# EAGLE design main (EAGLE 7.6.0)
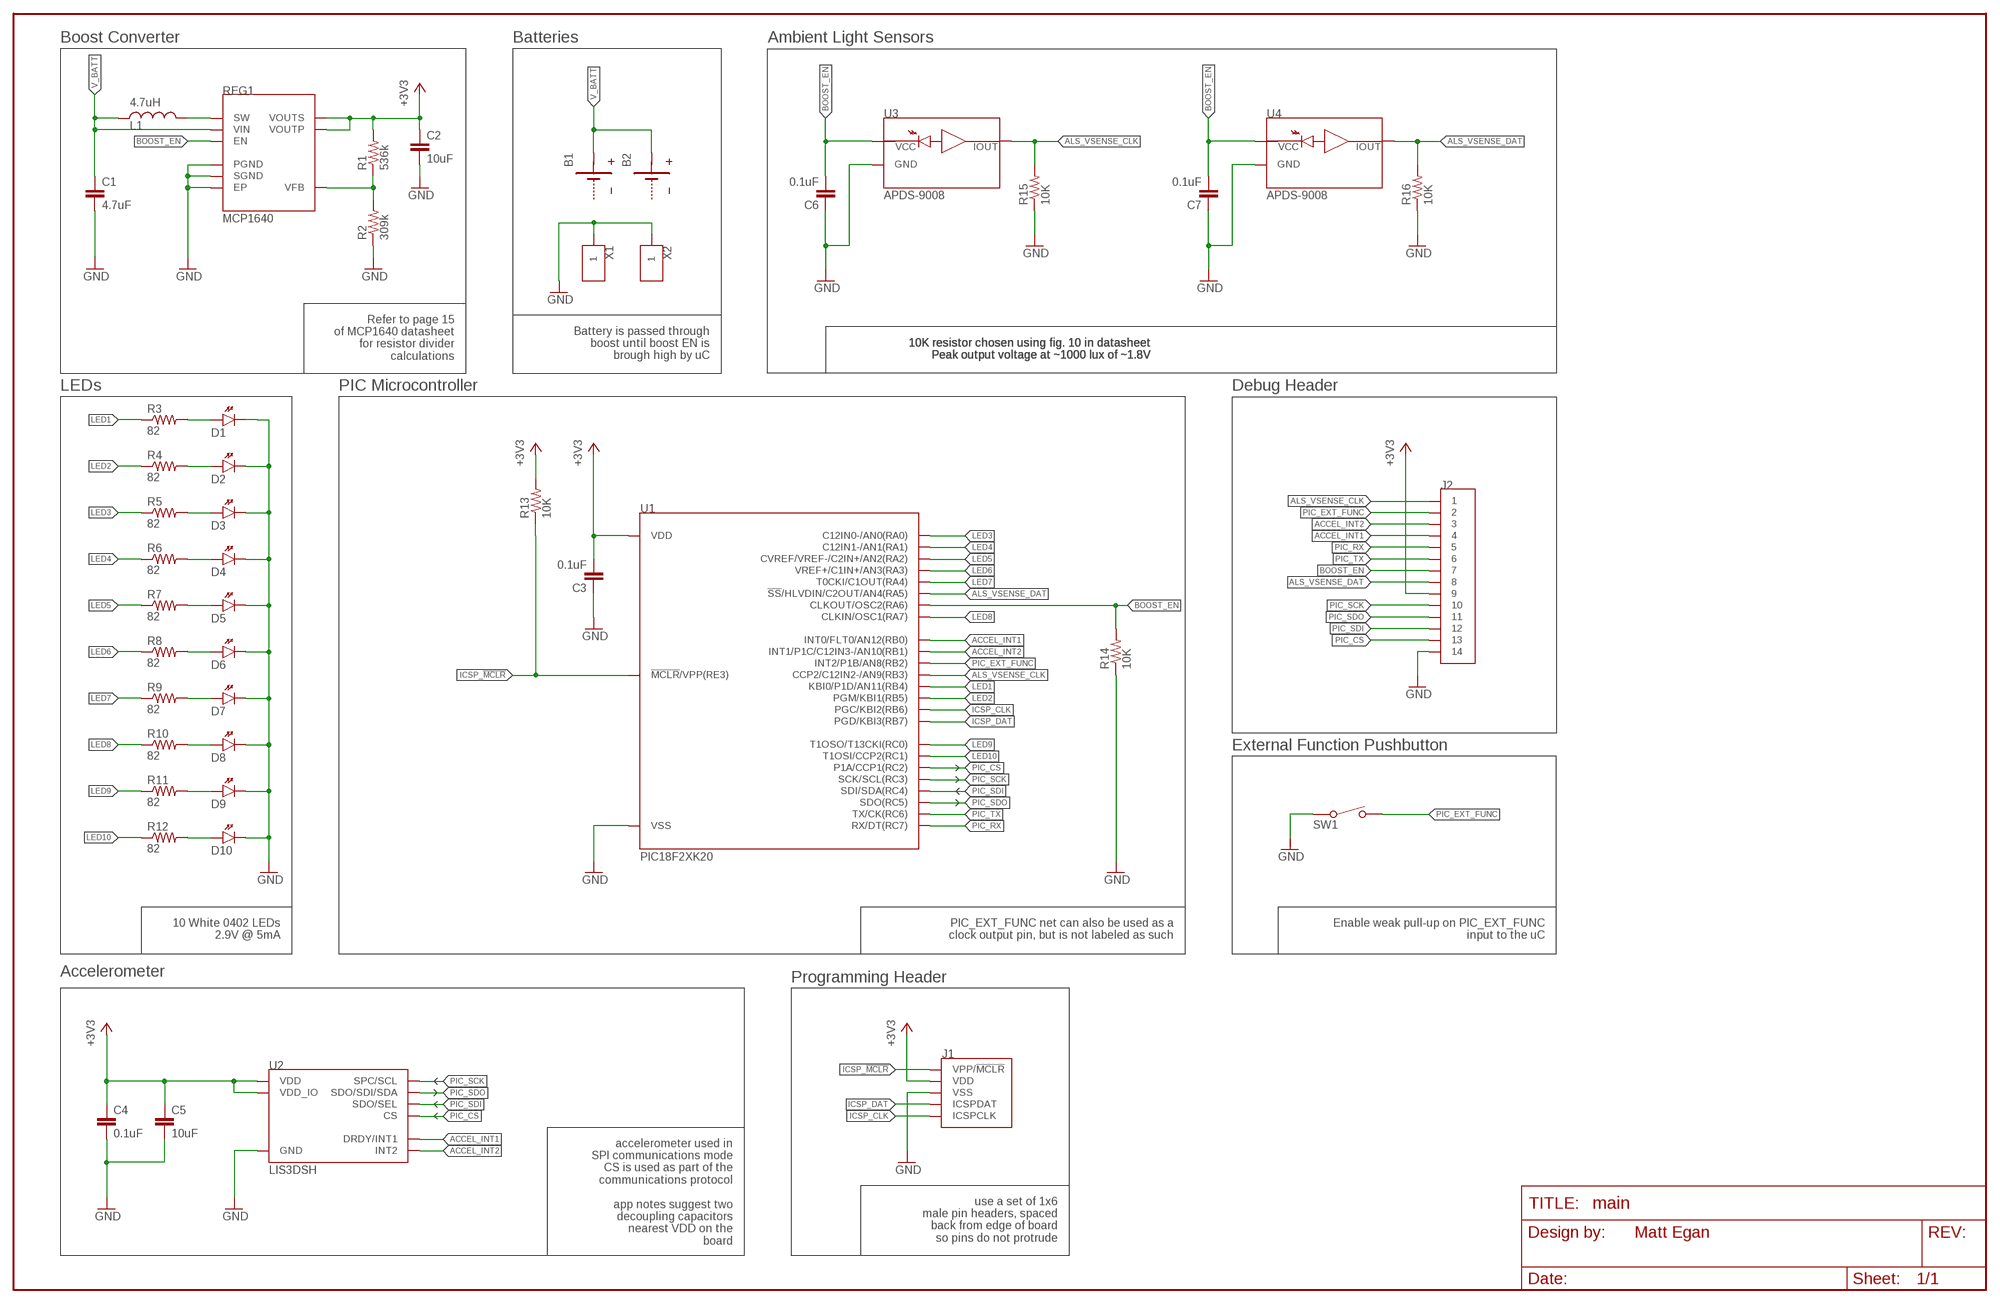
[diagram p0: schematic, sheet 1]

## Parts
B1  BATTERY-POS-HALF  [CR20XX-PLATED]
B2  BATTERY-POS-HALF  [CR20XX-PLATED]
C1  4.7uF  CAPACITOR0603  [SMD-0603]
C2  10uF  CAPACITOR0603  [SMD-0603]
C3  0.1uF  CAPACITOR0805  [SMD-0805]
C4  0.1uF  CAPACITOR0805  [SMD-0805]
C5  10uF  CAPACITOR0805  [SMD-0805]
C6  0.1uF  CAPACITOR0805  [SMD-0805]
C7  0.1uF  CAPACITOR0805  [SMD-0805]
D1  LED0603  [SMD-0603-P]
D2  LED0603  [SMD-0603-P]
D3  LED0603  [SMD-0603-P]
D4  LED0603  [SMD-0603-P]
D5  LED0603  [SMD-0603-P]
D6  LED0603  [SMD-0603-P]
D7  LED0603  [SMD-0603-P]
D8  LED0603  [SMD-0603-P]
D9  LED0603  [SMD-0603-P]
D10  LED0603  [SMD-0603-P]
J1  ICSP-HEADER1X6-0.1-ICSP-PADS  [1X6-0.1-ICSP-PADS]
J2  HEADER-141X14-0.05-PADS  [1X14-0.05-PADS]
L1  4.7uH  INDUCTOR  [VLF403210MT]
R1  536k  RESISTOR0603  [SMD-0603]
R2  309k  RESISTOR0603  [SMD-0603]
R3  82  RESISTOR0603  [SMD-0603]
R4  82  RESISTOR0603  [SMD-0603]
R5  82  RESISTOR0603  [SMD-0603]
R6  82  RESISTOR0603  [SMD-0603]
R7  82  RESISTOR0603  [SMD-0603]
R8  82  RESISTOR0603  [SMD-0603]
R9  82  RESISTOR0603  [SMD-0603]
R10  82  RESISTOR0603  [SMD-0603]
R11  82  RESISTOR0603  [SMD-0603]
R12  82  RESISTOR0603  [SMD-0603]
R13  10K  RESISTOR0603  [SMD-0603]
R14  10K  RESISTOR0603  [SMD-0603]
R15  10K  RESISTOR0603  [SMD-0603]
R16  10K  RESISTOR0603  [SMD-0603]
REG1  MCP1640  [DFN-8(2X3)]
SW1  B3U-3000P  [B3U-3000P]
U1  PIC18F2XK20  [QFN-28]
U2  LIS3DSH  [LGA-16]
U3  APDS-9008  [AVAGO-CHIPLED6]
U4  APDS-9008  [AVAGO-CHIPLED6]
X1  TE-2199248-X  [TE-2199248-X]
X2  TE-2199248-X  [TE-2199248-X]

## Nets
+3V3: C2.1 C3.2 C4.1 C5.1 J1.P$2(VDD) J2.P$9 R1.2 R13.2 REG1.6(VOUTP) REG1.7(VOUTS) U1.P$17(VDD) U2.P$1(VDD_IO) U2.P$14(VDD) U2.P$15(VDD)
ACCEL_INT1: J2.P$4 U1.P$18(INT0/FLT0/AN12(RB0)) U2.P$11(DRDY/INT1)
ACCEL_INT2: J2.P$3 U1.P$19(INT1/P1C/C12IN3-/AN10(RB1)) U2.P$9(INT2)
ALS_VSENSE_CLK: J2.P$1 R15.2 U1.P$21(CCP2/C12IN2-/AN9(RB3)) U3.P$6(P$IOUT)
ALS_VSENSE_DAT: J2.P$8 R16.2 U1.P$4(!SS!/HLVDIN/C2OUT/AN4(RA5)) U4.P$6(P$IOUT)
BOOST_EN: C6.2 C7.2 J2.P$7 R14.2 REG1.4(EN) U1.P$7(CLKOUT/OSC2(RA6)) U3.P$1(P$VCC) U4.P$1(P$VCC)
GND: C1.2 C2.2 C3.1 C4.2 C5.2 C6.1 C7.1 D1.- D2.- D3.- D4.- D5.- D6.- D7.- D8.- D9.- D10.- J1.P$3(VSS) J2.P$14 R2.1 R14.1 R15.1 R16.1 REG1.2(SGND) REG1.3(PGND) REG1.EP SW1.SW$1 U1.P$5(VSS) U1.P$16(VSS) U2.P$5(GND) U2.P$10(GND) U2.P$12(GND) U2.P$13(GND) U2.P$16(GND) U3.P$4(GND) U4.P$4(GND) X1.P$1 X1.P$2 X2.P$1 X2.P$2
ICSP_!MCLR!: J1.P$1(VPP/!MCLR!) R13.1 U1.P$26(!MCLR!/VPP(RE3))
ICSP_CLK: J1.P$5(ICSPCLK) U1.P$24(PGC/KBI2(RB6))
ICSP_DAT: J1.P$4(ICSPDAT) U1.P$25(PGD/KBI3(RB7))
LED1: R3.1 U1.P$22(KBI0/P1D/AN11(RB4))
LED2: R4.1 U1.P$23(PGM/KBI1(RB5))
LED3: R5.1 U1.P$27(C12IN0-/AN0(RA0))
LED4: R6.1 U1.P$28(C12IN1-/AN1(RA1))
LED5: R7.1 U1.P$1(CVREF/VREF-/C2IN+/AN2(RA2))
LED6: R8.1 U1.P$2(VREF+/C1IN+/AN3(RA3))
LED7: R9.1 U1.P$3(T0CKI/C1OUT(RA4))
LED8: R10.1 U1.P$6(CLKIN/OSC1(RA7))
LED9: R11.1 U1.P$8(T1OSO/T13CKI(RC0))
LED10: R12.1 U1.P$9(T1OSI/CCP2(RC1))
N$3: L1.P$2 REG1.5(SW)
N$5: R1.1 R2.2 REG1.1(VFB)
N$7: D1.+ R3.2
N$8: D2.+ R4.2
N$9: D3.+ R5.2
N$10: D4.+ R6.2
N$11: D5.+ R7.2
N$12: D6.+ R8.2
N$13: D7.+ R9.2
N$14: D8.+ R10.2
N$15: D9.+ R11.2
N$16: D10.+ R12.2
PIC_CS: J2.P$13 U1.P$10(P1A/CCP1(RC2)) U2.P$8(CS)
PIC_EXT_FUNC: J2.P$2 SW1.SW$2 U1.P$20(INT2/P1B/AN8(RB2))
PIC_RX: J2.P$5 U1.P$15(RX/DT(RC7))
PIC_SCK: J2.P$10 U1.P$11(SCK/SCL(RC3)) U2.P$4(SPC/SCL)
PIC_SDI: J2.P$12 U1.P$12(SDI/SDA(RC4)) U2.P$7(SDO/SEL)
PIC_SDO: J2.P$11 U1.P$13(SDO(RC5)) U2.P$6(SDO/SDI/SDA)
PIC_TX: J2.P$6 U1.P$14(TX/CK(RC6))
V_BATT: B1.P$1(P$+) B2.P$1(P$+) C1.1 L1.P$1 REG1.8(VIN)

## Notes on the sheet
- Boost Converter | Batteries | Ambient Light Sensors
- Refer to page 15
  of MCP1640 datasheet
  for resistor divider
  calculations
- Battery is passed through
  boost until boost EN is
  brough high by uC
- 10K resistor chosen using fig. 10 in datasheet
  Peak output voltage at ~1000 lux of ~1.8V
- 10K resistor chosen using fig. 10 in datasheet
  Peak output voltage at ~1000 lux of ~1.8V
- 10K resistor chosen using fig. 10 in datasheet
  Peak output voltage at ~1000 lux of ~1.8V
- LEDs | PIC Microcontroller | Debug Header
- External Function Pushbutton
- 10 White 0402 LEDs
  2.9V @ 5mA
- PIC_EXT_FUNC net can also be used as a
  clock output pin, but is not labeled as such
- Enable weak pull-up on PIC_EXT_FUNC
  input to the uC
- Accelerometer
- Programming Header
- accelerometer used in
  SPI communications mode
  CS is used as part of the
  communications protocol
  
  app notes suggest two
  decoupling capacitors
  nearest VDD on the
  board
- use a set of 1x6
  male pin headers, spaced
  back from edge of board
  so pins do not protrude
- Matt Egan

## Library data of the parts
B1 B2 = matt:BATTERY-POS-HALF
C1-C7 = matt:CAPACITOR
D1-D10 = matt:LED
J1 = matt:ICSP-HEADER
J2 = matt:HEADER-14
L1 = matt:INDUCTOR
R1-R16 = matt:RESISTOR
REG1 = matt:MCP1640
SW1 = matt:B3U-3000P
U1 = matt:PIC18F2XK20
U2 = matt:LIS3DSH
U3 U4 = matt:APDS-9008
X1 X2 = matt:TE-2199248-X

## Net classes
0 default: clearance 0.152 mm

## Board
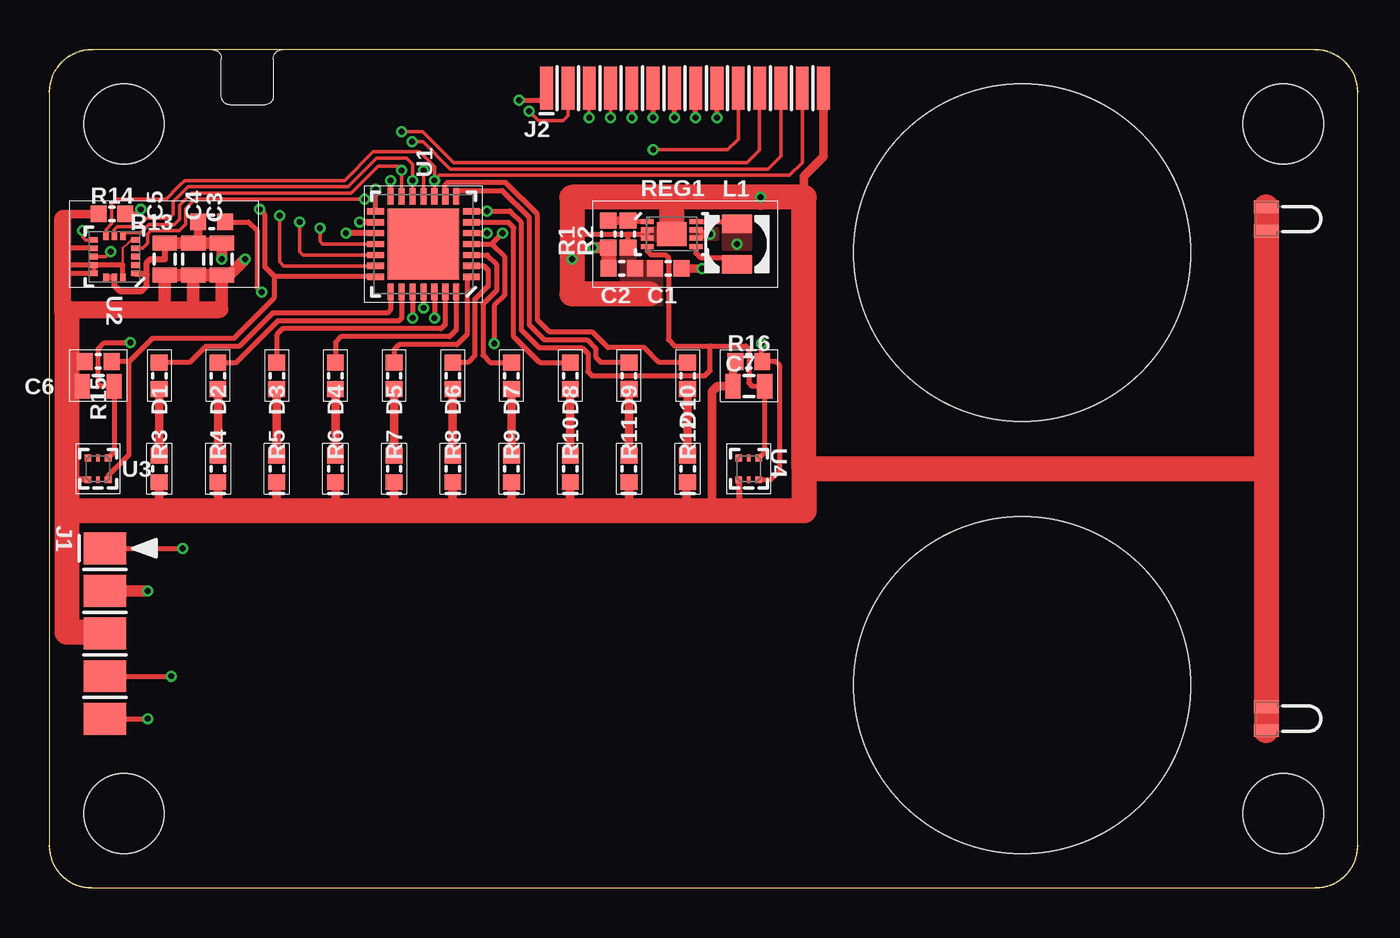
[diagram p1: board, top side]
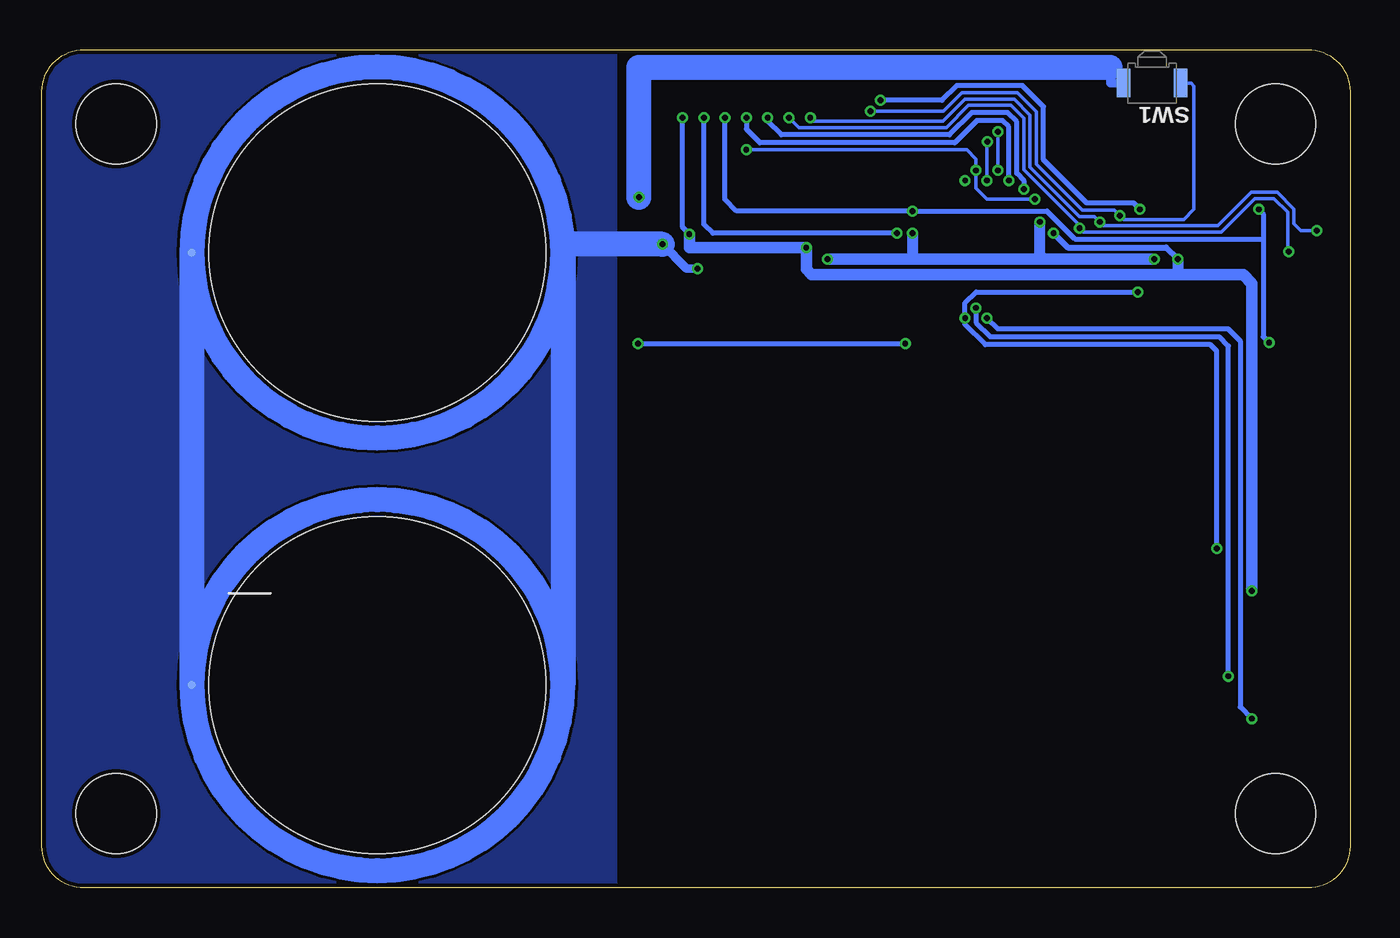
[diagram p2: board, bottom side, seen from below]

Size 78 x 50 mm. Coordinates in mm from the lower left corner, seen from the top.
Outline: 78,47.6 78,2.5 arc-90 75.5,0 2.5,0 arc-90 0,2.5 0,47.5 arc-90 2.5,50 75.6,50
Outline: 78,47.5 arc90 75.5,50
Copper layers (1*16): Top 0.035mm / dielectric 1.5mm / Bottom 0.035mm
Design rules "main": minimum track width 6mil, minimum drill 12mil, track to track 6mil, track to pad 6mil, pad to pad 6mil, via to via 6mil, smd to smd 0mil, copper to edge 10mil, drill to drill 10mil, minimum pad ring 10mil, minimum via ring 6mil, stop-mask expansion 2mil, vias tented up to drill 25mil, thermal gap 10mil
Holes 4.76 mm at 4.43,4.43 4.43,45.57 73.57,45.57 73.57,4.43

### Footprints (pad centres in the part's own frame; a part is rotated, then mirrored left to right if it is on the bottom)
CR20XX-PLATED = smd 0.5 x 0.5: P$1 0,11.06 | hole 20.1: 0,0
SMD-0603 = smd 0.95 x 1: 1 -0.8,0; 2 0.8,0
SMD-0805 = smd 0.9 x 1.45: 1 -0.95,0; 2 0.95,0
SMD-0603-P = smd 0.95 x 1: + -0.8,0; - 0.8,0
1X6-0.1-ICSP-PADS = smd 2.54 x 1.905: P$1 0,5.08; P$2 0,2.54; P$3 0,0; P$4 0,-2.54; P$5 0,-5.08
1X14-0.05-PADS = smd 2.54 x 0.762: P$1 0,8.255; P$2 0,6.985; P$3 0,5.715; P$4 0,4.445; P$5 0,3.175; P$6 0,1.905; P$7 0,0.635; P$8 0,-0.635; P$9 0,-1.905; P$10 0,-3.175; P$11 0,-4.445; P$12 0,-5.715; P$13 0,-6.985; P$14 0,-8.255
VLF403210MT = smd 1.1 x 1.8: P$1 -1.2,0; P$2 1.2,0
DFN-8(2X3) = smd 0.3 x 0.75: 1 -0.75,-1.45; 2 -0.25,-1.45; 3 0.25,-1.45; 4 0.75,-1.45; 5 0.75,1.45; 6 0.25,1.45; 7 -0.25,1.45; 8 -0.75,1.45 | smd 1.45 x 1.75: EP 0,0
B3U-3000P = smd 0.8 x 1.7: SW$1 -1.7,0; SW$2 1.7,0
QFN-28 = smd 1 x 0.37: P$1 -2.85,1.95; P$2 -2.85,1.3; P$3 -2.85,0.65; P$4 -2.85,0; P$5 -2.85,-0.65; P$6 -2.85,-1.3; P$7 -2.85,-1.95; P$15 2.85,-1.95; P$16 2.85,-1.3; P$17 2.85,-0.65; P$18 2.85,0; P$19 2.85,0.65; P$20 2.85,1.3; P$21 2.85,1.95 | smd 0.37 x 1: P$8 -1.95,-2.85; P$9 -1.3,-2.85; P$10 -0.65,-2.85; P$11 0,-2.85; P$12 0.65,-2.85; P$13 1.3,-2.85; P$14 1.95,-2.85; P$22 1.95,2.85; P$23 1.3,2.85; P$24 0.65,2.85; P$25 0,2.85; P$26 -0.65,2.85; P$27 -1.3,2.85; P$28 -1.95,2.85 | smd 4.25 x 4.25: P$29 0,0
LGA-16 = smd 0.45 x 0.34: P$1 -1.225,1; P$2 -1.225,0.5; P$3 -1.225,0; P$4 -1.225,-0.5; P$5 -1.225,-1; P$9 1.225,-1; P$10 1.225,-0.5; P$11 1.225,0; P$12 1.225,0.5; P$13 1.225,1 | smd 0.34 x 0.45: P$6 -0.5,-1.225; P$7 0,-1.225; P$8 0.5,-1.225; P$14 0.5,1.225; P$15 0,1.225; P$16 -0.5,1.225
AVAGO-CHIPLED6 = smd 0.4 x 0.4: P$1 0.6,0.65; P$3 -0.6,0.65; P$4 -0.6,-0.65; P$6 0.6,-0.65 | smd 0.2 x 0.4: P$2 0,0.65; P$5 0,-0.65
TE-2199248-X = smd 1.5 x 0.75: P$1 0,-0.725; P$2 0,0.725

### Placement (x,y rotation side)
B1  58,12.1 90 bottom
B2  58,37.9 90 bottom
C1  36.9,36.95 180 top
C2  34.12,36.95 0 top
C3  10.28,37.5 90 top
C4  8.57,37.5 270 top
C5  6.88,37.5 270 top
C6  2.9,29.93 0 top
C7  41.7,29.93 0 top
D1  6.55,25 270 top
D2  10.05,25 270 top
D3  13.55,25 270 top
D4  17.05,25 270 top
D5  20.55,25 270 top
D6  24.05,25 270 top
D7  27.55,25 270 top
D8  31.05,25 270 top
D9  34.55,25 270 top
D10  38.05,25 270 top
J1  3.3,15.18 0 top
J2  37.9,47.7 90 top
L1  41,38.4 270 top
R1  33.33,39 270 top
R2  34.5,39 90 top
R3  6.55,30.55 270 top
R4  10.05,30.55 270 top
R5  13.55,30.55 270 top
R6  17.05,30.55 270 top
R7  20.55,30.55 270 top
R8  24.05,30.55 270 top
R9  27.55,30.55 270 top
R10  31.05,30.55 270 top
R11  34.55,30.55 270 top
R12  38.05,30.55 270 top
R13  9.68,39.73 180 top
R14  3.73,40.2 0 top
R15  2.9,31.4 0 top
R16  41.7,31.4 0 top
REG1  37.1,39 270 top
SW1  11.8,48 0 bottom
U1  22.3,38.4 180 top
U2  3.88,37.65 180 top
U3  2.9,25 0 top
U4  41.7,25 0 top
X1  72.55,10.1 0 top
X2  72.55,39.9 0 top

### Tracks (layer width: path | path; a pad name or v marks a point on that pad's centre or on a via)
+3V3  (via drill 0.35)
  Top 0.3: v39.8,45.95 J2.P$9
  Top 0.35: U2.P$14 U2.P$15 3.88,35.92 4.2,35.6 5.5,35.6 5.8,35.9 5.8,36.6 | 5.8,36.6 5.8,37.3 6,37.5 6.9,37.5 6.9,38.42 C5.1 | U2.P$1 5.75,36.65 5.8,36.6 | C3.2 10.28,38.48 | 10.28,38.48 10.3,38.5 | 10.28,38.48 10.25,38.45 | U1.P$17 v17.68,39.05
  Top 0.5: v39.4,39 39,39 | 8.88,38.45 R13.2
  Top 0.65: C3.2 v10.28,37.5
  Top 0.7: R1.2 v32.42,38.2 | C5.1 C4.1 8.88,38.45 10.25,38.45 | v5.85,17.71 J1.P$2
  Top 0.9: R1.2 C2.1
  Bottom 0.3: v39.4,39 39.8,39.4 v39.8,45.95
  Bottom 0.35: v17.68,39.05 16.82,38.2 10.97,38.2 v10.28,37.5
  Bottom 0.65: v10.28,37.5 10.28,36.58 10.25,36.58
  Bottom 0.7: v39.4,39 39.4,38.2 v32.42,38.2 32.42,36.9 32.1,36.58 10.25,36.58 6.38,36.58 5.85,36.05 v5.85,17.71
  pour Top (no thermals): 38.27,39.3 38.27,38.7 39.83,38.7 39.83,39.3
ACCEL_INT1  (via drill 0.35)
  Top 0.2: U2.P$11 3.35,37.65 v3.65,37.95 | U1.P$18 16.3,38.4 16.12,38.58 v16.12,39.35 | J2.P$4 v33.45,45.95
  Bottom 0.2: v3.65,37.95 3.73,38.02 3.73,40.3 4.55,41.12 5.67,41.12 7.67,39.12 15.9,39.12 v16.12,39.35 16.12,39.52 19.45,42.85 19.45,45.9 20.23,46.67 22.75,46.67 24.07,45.35 32.85,45.35 v33.45,45.95
ACCEL_INT2  (via drill 0.35)
  Top 0.2: U2.P$9 2.17,38.65 1.98,38.85 v1.98,39.2 | U1.P$19 15.12,37.75 14.93,37.95 v14.93,39.73 | J2.P$3 v32.19,45.95
  Top 0.3: J2.P$3
  Bottom 0.2: v1.98,39.2 2.92,39.2 3.35,39.62 3.35,40.5 4.35,41.5 5.88,41.5 7.88,39.5 14.7,39.5 v14.93,39.73 15.25,40.05 16.12,40.05 19.07,43 19.07,46.1 20.02,47.05 22.95,47.05 24.27,45.73 31.96,45.73 v32.19,45.95
ALS_VSENSE_CLK  (via drill 0.35)
  Top 0.3: 4.75,31.4 4.75,25.85 3.5,24.6 U3.P$6 | 4.75,31.4 R15.2 | 4.75,31.4 6.12,32.77 10.97,32.77 13.43,35.23 13.43,36.45 | U1.P$21 13.43,36.45 | 13.43,36.45 12.85,37.02 12.85,40.15 v12.53,40.48 | J2.P$1 arc90 29.62,47.68 29.62,46.92 arc90 29.57,46.98 v28,46.98
  Bottom 0.3: v12.53,40.48 12.9,40.85 15.7,40.85 18.27,43.42 18.27,46.6 19.52,47.85 23.45,47.85 24.32,46.98 v28,46.98
ALS_VSENSE_DAT  (via drill 0.35)
  Top 0.3: U4.P$6 43,24.35 43.55,24.9 43.55,31.15 43.3,31.4 R16.2 arc-90 42.45,31.45 v42.45,32.48 | U1.P$4 26.38,38.4 | 26.38,38.4 26.4,38.4 27.12,37.67 27.12,35.33 26.52,34.73 v26.52,32.48 | 26.38,38.4 v27.02,39.05 | v38.52,45.95 J2.P$8 arc-90 J2.P$8
  Bottom 0.3: v42.45,32.48 v26.52,32.48 | v27.02,39.05 38,39.05 38.52,39.58 v38.52,45.95
BOOST_EN  (via drill 0.35)
  Top 0.3: U3.P$1 3.85,26 C6.2 2.9,29.93 2.9,32.15 3.27,32.52 v4.83,32.52 | U4.P$1 42.65,26 C7.2 41.9,29.93 41.7,30.12 41.7,32.15 41.52,32.33 39.4,32.33 | REG1.4 35.65,37.98 35.85,37.77 36.73,37.77 36.9,37.6 36.9,32.7 37.27,32.33 39.4,32.33 | 39.4,32.33 39.4,30.85 39.1,30.55 32.35,30.55 32.1,30.8 32.1,31.88 31.75,32.23 29.2,32.23 28.15,33.27 28.15,39.67 27.48,40.35 arc90 27.45,40.38 v26.1,40.38 25.18,40.38 U1.P$7 | v5.45,40.48 5.17,40.2 R14.2 | v37.27,45.95 J2.P$7
  Bottom 0.3: v4.83,32.52 5.17,32.88 5.17,38.7 | 5.17,38.7 16.4,38.7 18.07,40.38 v26.1,40.38 36.58,40.38 37.27,41.08 v37.27,45.95 | v5.45,40.48 5.17,40.2 5.17,38.7
GND  (via drill 0.35)
  Top 0.152: 4.38,37.15 4.38,38.15 4.71,38.48 4.87,38.65 U2.P$5
  Top 0.3: R2.1 34.5,39 | 34.5,39 35.65,39 REG1.3 | 38.2,24.35 arc90 D10.- | 40.75,31.25 arc-90 R16.1 | REG1.EP 37,39 | U2.P$16 4.38,37.15 U2.P$12 | U2.P$12 U2.P$13 0.95,36.65 arc-90 0.9,36.7 | 30.95,39 34.5,39 | U2.P$10 0.85,38.15 arc90 0.8,38.1 | U2.P$12 0.85,37.15 arc90 0.8,37.1
  Top 0.35: D10.- 38,24.2 | 34.55,22.55 34.6,22.5 | 38,22.9 37.6,22.5 | 31.05,22.55 31,22.5 | 24.05,22.6 24.15,22.5 | 17.05,22.9 16.65,22.5 | 13.55,22.5 13.1,22.5 | 10.05,22.5 10.2,22.5 | U3.P$4 1.05,24.35 | C6.1 1.95,30 1.05,30 | R15.1 2.1,31.35 1.05,31.35 | U4.P$4 41.1,22.5 41,22.5 | U1.P$5 v26.1,39.05 | U1.P$16 18.52,39.7 arc-90 v18.5,39.73
  Top 0.5: 40.75,31.25 C7.1 39.83,29.93 39.5,29.6 39.5,22.5 | 6.88,34.38 arc-90 6.8,34.3 | D9.- 34.55,22.55 | 38,24.2 38,22.9 | D8.- 31.05,22.55 | D7.- 27.55,22.5 | D6.- 24.05,22.6 | D5.- 20.55,22.5 | D4.- 17.05,22.9 | D3.- 13.55,22.5 | D2.- 10.05,22.5 | D1.- 6.55,22.5 | 44.8,41.2 45,41.3 45,42.45 46.16,43.6 J2.P$14 | R14.1 1.05,40.2 arc90 0.8,39.95
  Top 0.7: C3.1 10.72,36.55 v11.68,37.5
  Top 0.75: 6.88,34.38 C5.2 C4.2 | C4.2 C3.1 10.28,34.5 10.15,34.5 | C4.2 8.57,34.4
  Top 1: 0.8,39.95 0.8,38.1 0.8,37.1 0.8,34.3 1.05,34.3 1.25,34.5 10.15,34.5
  Top 1.5: X2.P$2 X2.P$1 72.55,25 | 72.55,25 X1.P$2 X1.P$1 | 72.55,25 45,25 | 45,25 45,41.2 44.8,41.2 v42.4,41.2 37.1,41.2 | 1.05,22.5 6.55,22.5 10.2,22.5 13.1,22.5 16.65,22.5 20.55,22.5 24.15,22.5 27.55,22.5 31,22.5 34.6,22.5 37.6,22.5 39.5,22.5 41,22.5 45,22.5 45,25 | 1.05,22.5 1.05,24.35 1.05,30 1.05,31.35 1.05,34.3 | J1.P$3 3.17,15.18 arc-90 3.1,15.25 1.05,15.25 1.05,22.5 | 37.1,41.2 REG1.EP | 37.1,41.2 31.15,41.2 31.15,35.45 35.75,35.45
  Bottom 0.5: SW1.SW$1 14.3,48 14.3,48.95
  Bottom 0.65: 18.5,37.73 v18.5,39.73 | v26.1,39.05 26.1,37.55 26.15,37.5
  Bottom 0.7: v11.68,37.5 18.27,37.5 | 18.27,37.5 18.5,37.73 | 18.27,37.5 26.15,37.5 v31.15,37.5
  Bottom 1.5: v42.4,41.2 42.4,48.95 14.3,48.95
  pour Top (no thermals): 35.33,39.35 35.33,38.65 36.27,38.65 36.27,39.35
  pour Top (no thermals): 34.1,37.88 34.1,36.55 36.48,36.55 36.48,37.35 34.9,37.35 34.9,37.88
  pour Top (no thermals): 34.1,37.25 34.1,34.8 36.3,34.8 36.5,34.8 36.5,37.35 34.1,37.35
ICSP_!MCLR!  (via drill 0.35)
  Top 0.3: U1.P$26 v22.95,34 | R13.1 11.88,39.73 12.38,39.23 12.38,35.83 v12.65,35.55 | J1.P$1 v7.95,20.25
  Bottom 0.3: v12.65,35.55 22.3,35.55 22.95,34.9 v22.95,34 22.95,33.6 21.75,32.4 8.32,32.4 7.95,32.02 v7.95,20.25
ICSP_CLK  (via drill 0.35)
  Top 0.3: U1.P$24 v21.65,34 | J1.P$5 v5.85,10.1
  Bottom 0.3: v21.65,34 21,33.35 7.28,33.35 6.55,32.62 6.55,10.8 v5.85,10.1
ICSP_DAT  (via drill 0.35)
  Top 0.3: U1.P$25 v22.3,34.6 | J1.P$4 v7.25,12.63
  Bottom 0.3: v22.3,34.6 22.3,33.73 21.45,32.88 7.8,32.88 7.25,32.33 v7.25,12.63
LED1
  Top 0.3: R3.1 8.35,31.35 9.3,32.3 11.3,32.3 13.3,34.3 20.15,34.3 20.35,34.5 U1.P$22
LED2
  Top 0.3: U1.P$23 21,34 20.82,33.83 13.6,33.83 11.12,31.35 R4.1
LED3
  Top 0.3: U1.P$27 23.6,33.6 23.35,33.35 13.9,33.35 13.55,33 R5.1
LED4
  Top 0.3: U1.P$28 24.25,33.27 23.85,32.88 17.38,32.88 17.05,32.55 R6.1
LED5
  Top 0.3: R7.1 20.55,32.1 20.85,32.4 24.3,32.4 24.9,33 24.9,36.45 U1.P$1
LED6
  Top 0.3: U1.P$2 25.9,37.1 26.18,36.83 26.18,35.92 25.38,35.12 25.38,31.77 24.95,31.35 R8.1
LED7
  Top 0.3: U1.P$3 26.1,37.75 26.65,37.2 26.65,35.62 25.85,34.83 25.85,31.77 26.27,31.35 R9.1
LED8
  Top 0.3: U1.P$6 27.35,39.7 27.68,39.38 27.68,32.9 29.23,31.35 R10.1
LED9
  Top 0.3: R11.1 32.9,31.35 32.58,31.68 32.58,32.17 32.05,32.7 29.5,32.7 28.62,33.58 28.62,39.98 27,41.6 24.25,41.6 U1.P$8
LED10
  Top 0.3: R12.1 36.35,31.35 35.48,32.23 33.3,32.23 32.35,33.17 29.8,33.17 29.1,33.88 29.1,40.17 27.2,42.08 23.73,42.08 23.6,41.95 U1.P$9
N$3
  Top 0.3: REG1.5 38.55,37.85 38.8,37.6 40.35,37.6 arc90 40.75,37.2 L1.P$2
N$5
  Top 0.3: REG1.1 34.55,39.75 R2.2
  Top 0.5: R1.1 R2.2
N$7
  Top 0.5: R3.2 D1.+
N$8
  Top 0.5: R4.2 D2.+
N$9
  Top 0.5: R5.2 D3.+
N$10
  Top 0.5: R6.2 D4.+
N$11
  Top 0.5: R7.2 D5.+
N$12
  Top 0.5: R8.2 D6.+
N$13
  Top 0.5: R9.2 D7.+
N$14
  Top 0.5: R10.2 D8.+
N$15
  Top 0.5: R11.2 D9.+
N$16
  Top 0.5: R12.2 D10.+
PIC_CS  (via drill 0.35)
  Top 0.2: U2.P$8 3.38,39.27 3.72,39.61 3.72,40.83 3.98,41.09 6.96,41.09 7.72,41.88 8.05,42.2 17.6,42.2 19.3,43.9 22.07,43.9 22.95,43.02 v22.95,42.2 | v22.95,42.2 U1.P$10 | v22.95,42.2 23.25,42.5 44.12,42.5 44.88,43.26 J2.P$13
PIC_EXT_FUNC  (via drill 0.35)
  Top 0.2: U1.P$20 13.97,37.1 13.72,37.35 v13.72,40.1 | v28.6,46.33 29.15,45.77 30.62,45.77 30.91,46.06 J2.P$2
  Top 0.3: 30.93,47.69 J2.P$2
  Bottom 0.2: SW1.SW$2 9.47,48 9.3,47.83 9.3,40.48 9.9,39.88 13.5,39.88 v13.72,40.1 14.05,40.42 15.95,40.42 18.7,43.17 18.7,46.3 19.82,47.42 23.15,47.42 24.25,46.33 v28.6,46.33
PIC_RX  (via drill 0.35)
  Top 0.3: U1.P$15 v19.45,41.67 | J2.P$5 v34.73,45.95
  Bottom 0.3: v34.73,45.95 34.73,45.73 33.91,44.92 23.88,44.92 22.55,46.25 20.43,46.25 19.88,45.7 19.88,42.62 19.45,42.2 v19.45,41.67
PIC_SCK  (via drill 0.35)
  Top 0.2: U2.P$4 5.55,38.15 5.85,38.45 5.85,39 6.05,39.2 7.72,39.2 8.12,39.6 8.12,40.52 8.68,41.08 v18.8,41.08 | 22.25,41.3 arc90 U1.P$11 v22.3,42.8 | J2.P$10 41.08,44.66 40.44,44.02 v36,44.02
  Bottom 0.2: v18.8,41.08 21.65,41.08 22.3,41.73 v22.3,42.8 22.3,43.48 22.85,44.02 v36,44.02
PIC_SDI  (via drill 0.35)
  Top 0.2: U2.P$7 3.88,39.27 4.05,39.44 5.29,39.44 5.79,39.94 7.12,39.94 7.38,40.19 7.38,40.92 8.28,41.83 17.8,41.83 19.5,43.52 21.3,43.52 21.65,43.17 v21.65,42.2 U1.P$12 | v21.62,44.5 22.27,44.5 23.9,42.88 42.85,42.88 43.62,43.63 J2.P$12
  Bottom 0.2: v21.62,44.5 arc-90 21.65,44.48 v21.65,42.2
PIC_SDO  (via drill 0.35)
  Top 0.2: U2.P$6 4.58,39.08 5.43,39.08 5.92,39.57 7.42,39.57 7.75,39.9 7.75,40.73 8.47,41.45 18,41.45 19.6,43.05 20.75,43.05 v21,42.8 U1.P$13 | v21,45.1 22.25,45.1 24.1,43.25 41.59,43.25 42.34,44.01 J2.P$11
  Bottom 0.2: v21,42.8 v21,45.1
PIC_TX  (via drill 0.35)
  Top 0.3: U1.P$14 v20.35,42.2 | J2.P$6 v35.99,45.95
  Bottom 0.3: v20.35,42.2 20.35,45.4 20.73,45.77 22.25,45.77 23.57,44.45 35.19,44.45 35.99,45.26 v35.99,45.95
V_BATT  (via drill 0.35)
  Top 0.3: REG1.8 40.85,39.75 L1.P$1
  Top 0.5: C1.1 v38.9,36.95
  Bottom 0.5: v38.9,36.95 39.55,36.95 v41,38.4
  Bottom 1.5: B2.P$1 B1.P$1 | 46.94,12.1 46.94,37.9 arc90 46.44,38.4 v41,38.4
  pour Top (no thermals): 40.2,39.2 40.2,38.1 41.8,38.1 41.8,39.2
  pour Bottom: 43.8,49.9 43.8,0.1 77.9,0.1 77.9,49.9